# EAGLE design RF-Gen_RF-Stage (EAGLE 4.16)

## Sheet 1 of 4
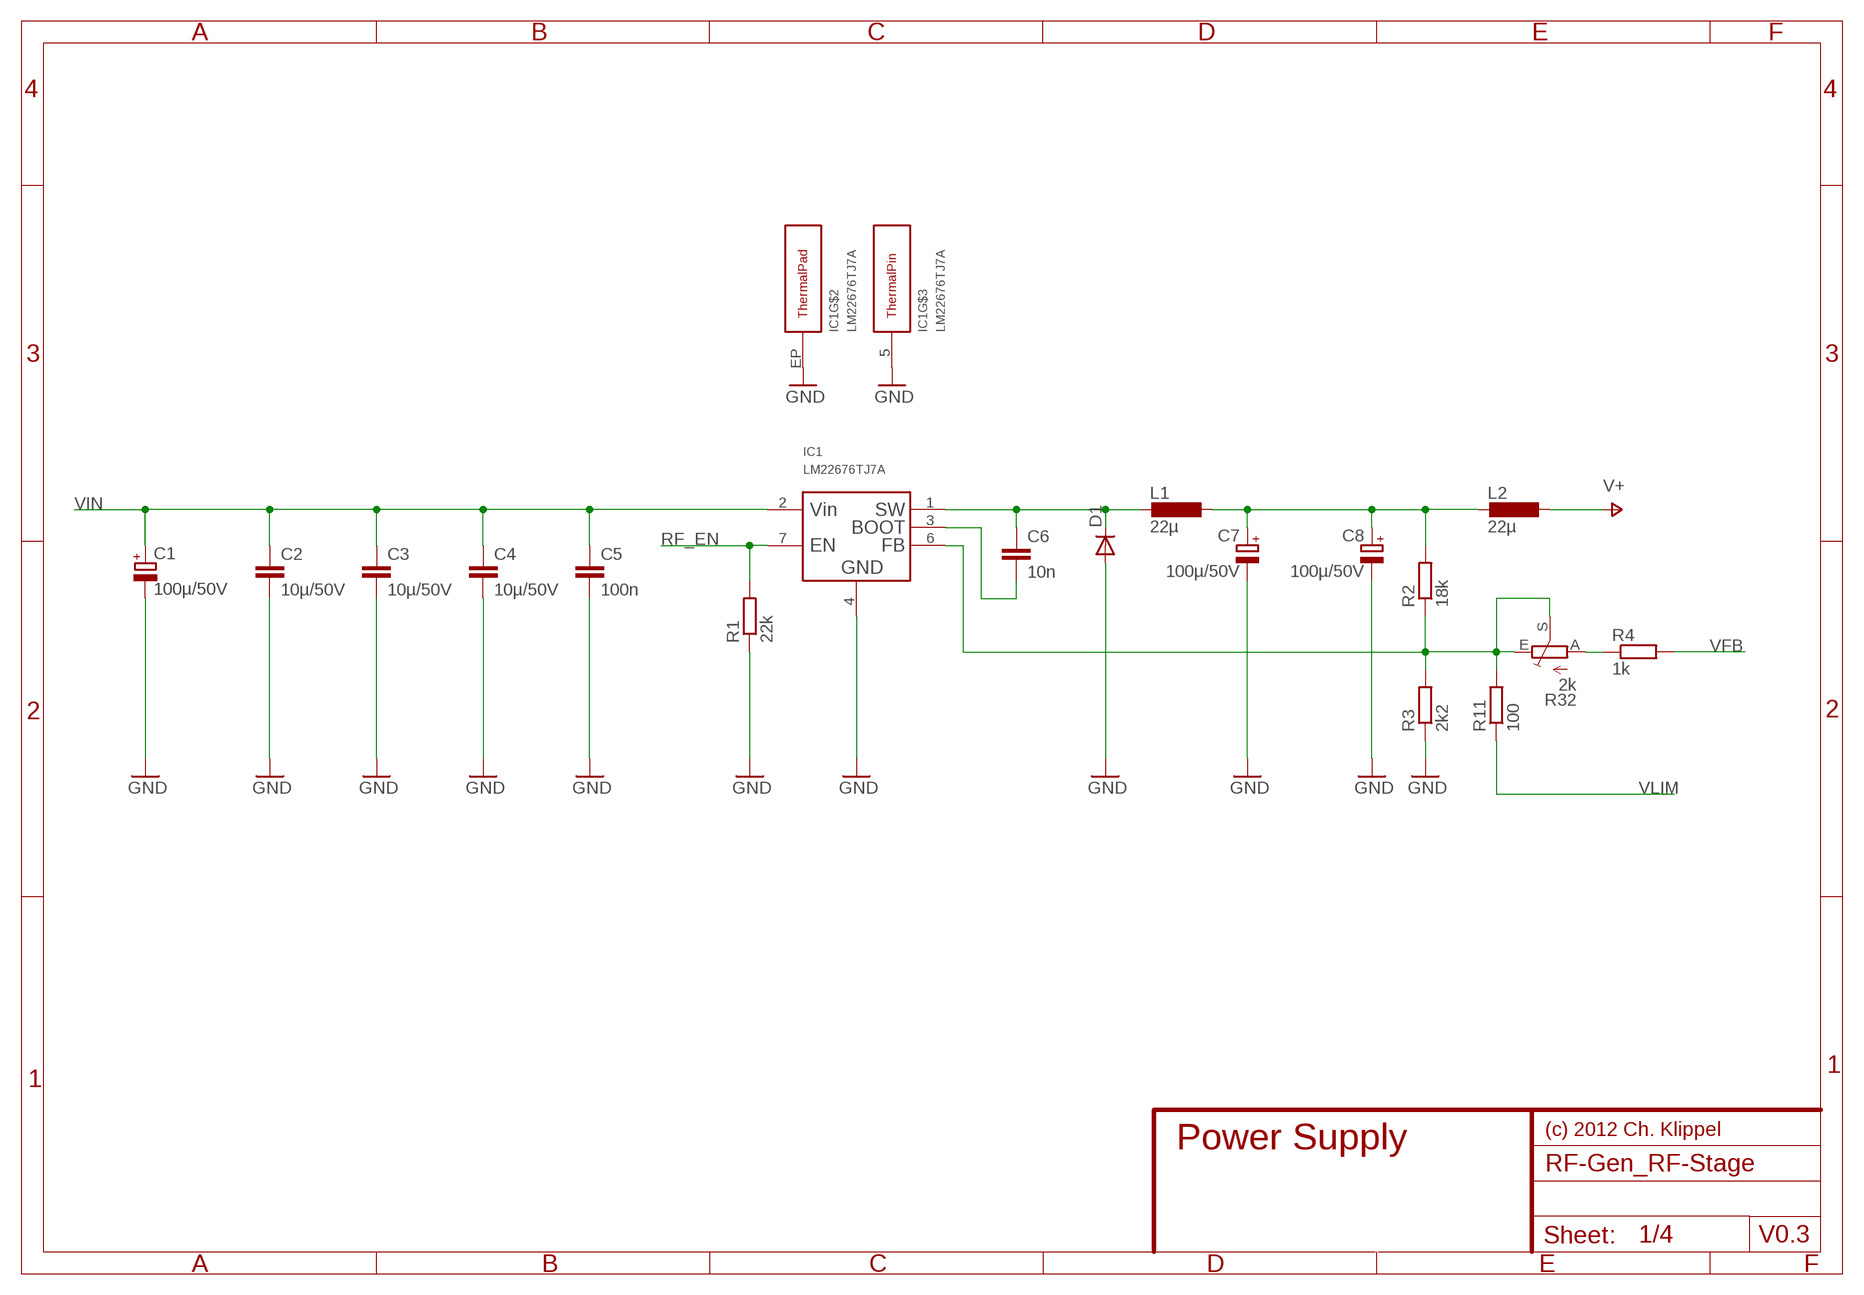
[diagram p0: schematic, sheet 1]

### Parts
C1  100µ/50V  C-POL-EU-AL_100_108  [CAP_AL_100_108]
C2  10µ/50V  C-EU-1210  [C_1210_REFLOW]
C3  10µ/50V  C-EU-1210  [C_1210_REFLOW]
C4  10µ/50V  C-EU-1210  [C_1210_REFLOW]
C5  100n  C-EU-0805  [C_0805_REFLOW]
C6  10n  C-EU-1206  [C_1206_REFLOW]
C7  100µ/50V  C-POL-EU-AL_100_108  [CAP_AL_100_108]
C8  100µ/50V  C-POL-EU-AL_100_108  [CAP_AL_100_108]
D1  DIODE-SMB  [SMB]
IC1  LM22676TJ7A  [TO-263_THIN]
L1  22µ  L-EU-SSR1260  [SSR1260]
L2  22µ  L-EU-SSR1260  [SSR1260]
R1  22k  R-EU-0805  [R_0805_REFLOW]
R2  18k  R-EU-0805  [R_0805_REFLOW]
R3  2k2  R-EU-0805  [R_0805_REFLOW]
R4  1k  R-EU-0805  [R_0805_REFLOW]
R11  100  R-EU-0805  [R_0805_REFLOW]
R32  2k  TRIM_EU-3364W  [3364W]

### Nets
GND: C1.- C2.P$2 C3.P$2 C4.P$2 C5.P$2 C7.- C8.- D1.A IC1.4(GND) IC1.5(THERMALPIN) IC1.EP(THERMALPAD) R1.P$1 R3.P$1 ; also sheet 2,3,4
N$8: C6.P$2 IC1.3(BOOT)
N$19: R4.P$1 R32.A
N$23: IC1.6(FB) R2.P$1 R3.P$2 R11.P$2 R32.E R32.S
RF_EN: IC1.7(EN) R1.P$2 ; also sheet 2,4
V+: L2.1 ; also sheet 2
VFB: R4.P$2 ; also sheet 4
VIN: C1.+ C2.P$1 C3.P$1 C4.P$1 C5.P$1 IC1.2(VIN) ; also sheet 4
VLIM: R11.P$1 ; also sheet 4
VREG: C7.+ C8.+ L1.1 L2.2 R2.P$2 ; also sheet 4
VSW: C6.P$1 D1.C IC1.1(SW) L1.2

### Notes on the sheet
- (c) 2012 Ch. Klippel
- Power Supply
- V0.3

## Sheet 2 of 4
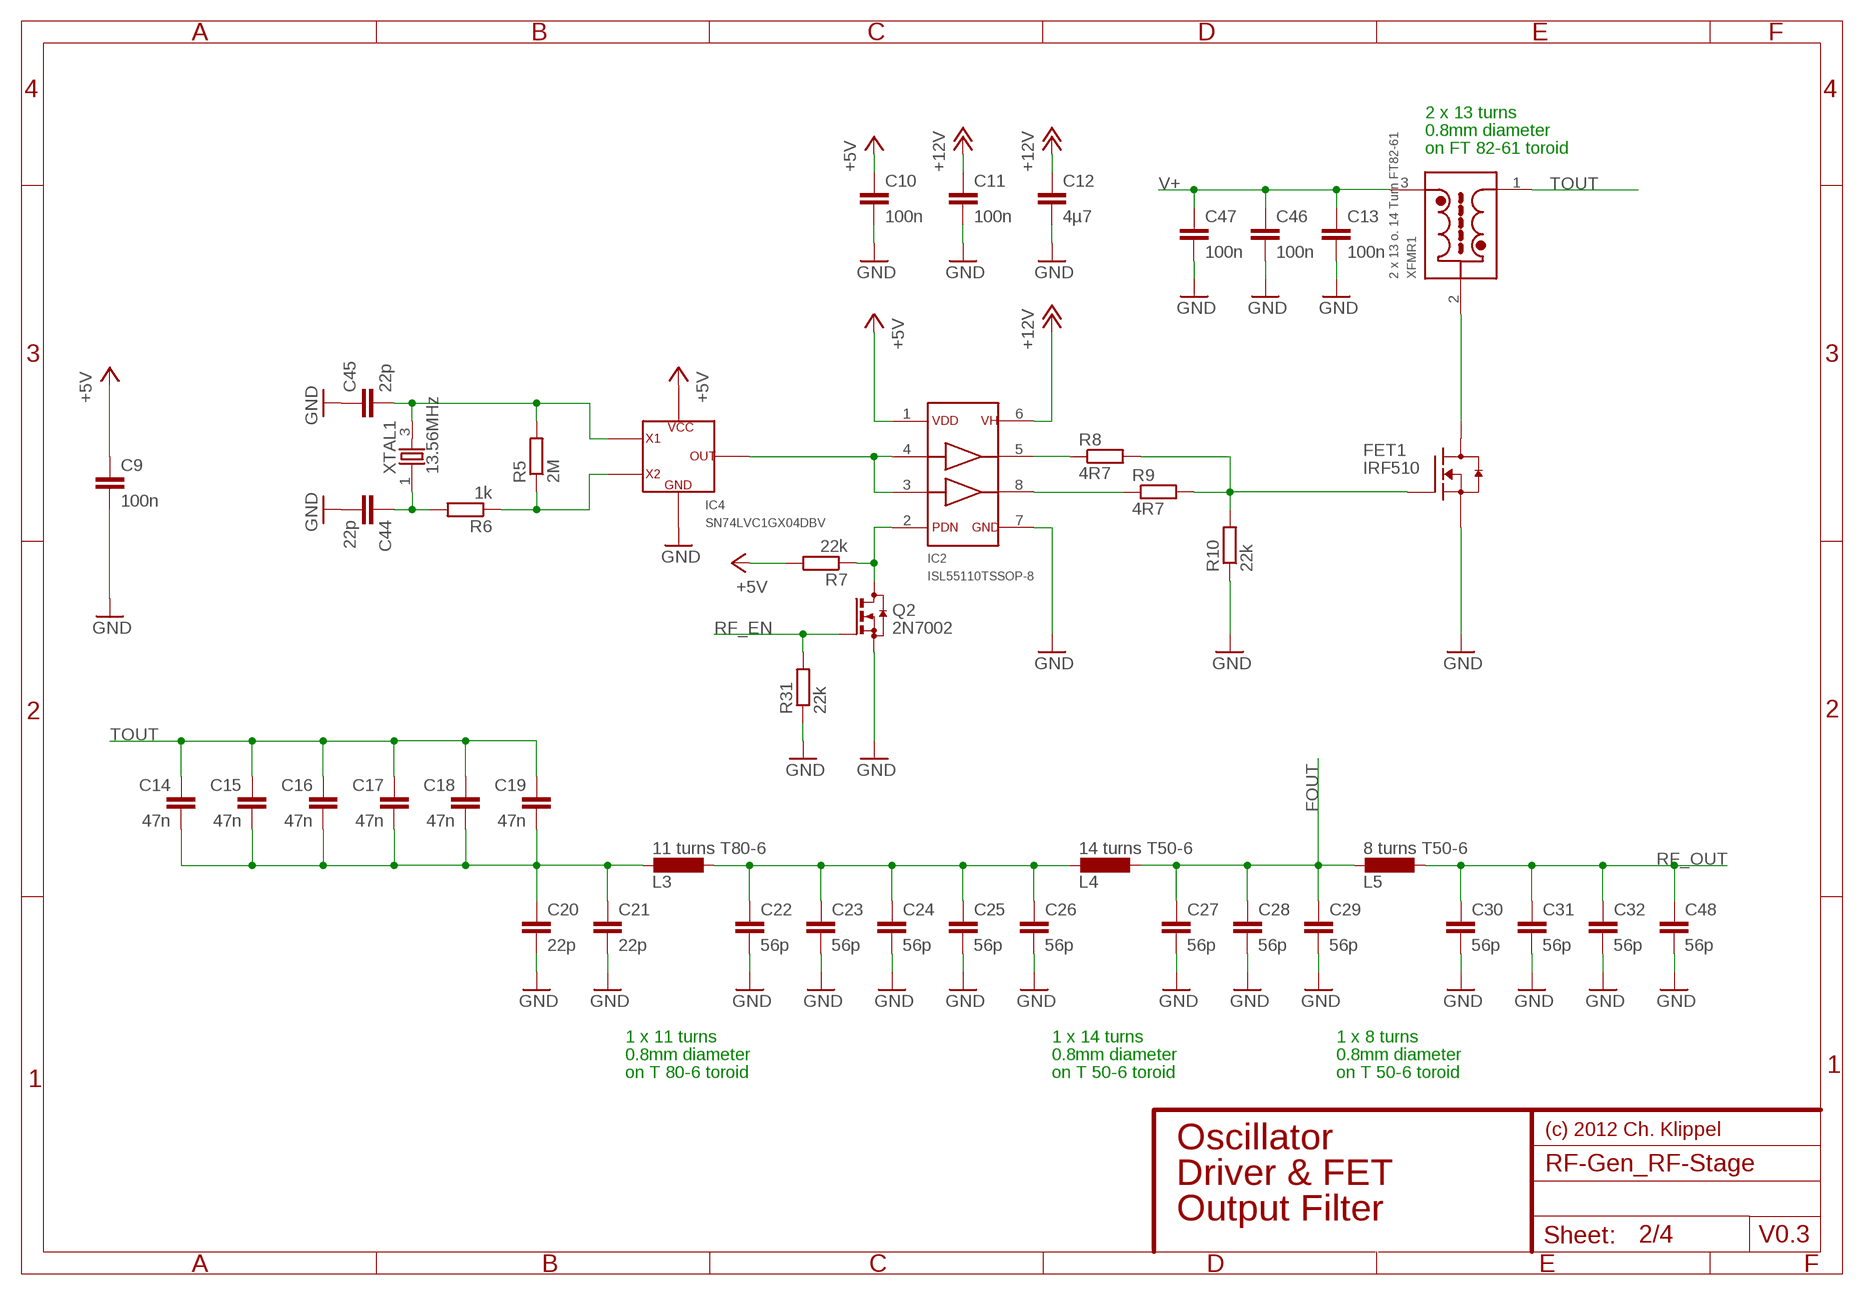
[diagram p1: schematic, sheet 2]

### Parts
C9  100n  C-EU-0805  [C_0805_REFLOW]
C10  100n  C-EU-0805  [C_0805_REFLOW]
C11  100n  C-EU-0805  [C_0805_REFLOW]
C12  4µ7  C-EU-1206  [C_1206_REFLOW]
C13  100n  C-EU-1206  [C_1206_REFLOW]
C14  47n  C-EU-1206  [C_1206_REFLOW]
C15  47n  C-EU-1206  [C_1206_REFLOW]
C16  47n  C-EU-1206  [C_1206_REFLOW]
C17  47n  C-EU-1206  [C_1206_REFLOW]
C18  47n  C-EU-1206  [C_1206_REFLOW]
C19  47n  C-EU-1206  [C_1206_REFLOW]
C20  22p  C-EU-1206  [C_1206_REFLOW]
C21  22p  C-EU-1206  [C_1206_REFLOW]
C22  56p  C-EU-1206  [C_1206_REFLOW]
C23  56p  C-EU-1206  [C_1206_REFLOW]
C24  56p  C-EU-1206  [C_1206_REFLOW]
C25  56p  C-EU-1206  [C_1206_REFLOW]
C26  56p  C-EU-1206  [C_1206_REFLOW]
C27  56p  C-EU-1206  [C_1206_REFLOW]
C28  56p  C-EU-1206  [C_1206_REFLOW]
C29  56p  C-EU-1206  [C_1206_REFLOW]
C30  56p  C-EU-1206  [C_1206_REFLOW]
C31  56p  C-EU-1206  [C_1206_REFLOW]
C32  56p  C-EU-1206  [C_1206_REFLOW]
C44  22p  C-EU-0805  [C_0805_REFLOW]
C45  22p  C-EU-0805  [C_0805_REFLOW]
C46  100n  C-EU-1206  [C_1206_REFLOW]
C47  100n  C-EU-1206  [C_1206_REFLOW]
C48  56p  C-EU-1206  [C_1206_REFLOW]
FET1  IRF510  NFETTO22_INPCB  [TO220_INPCB]
IC2  ISL55110TSSOP-8  [TSSOP-8]
IC4  SN74LVC1GX04DBV  [DBV-R-PDSO-G6]
L3  11 turns T80-6  L-EU-T80_U  [L_T80_U]
L4  14 turns T50-6  L-EU-T50_U  [L_T50_U]
L5  8 turns T50-6  L-EU-T50_U2  [L_T50_U2]
Q2  2N7002  BSS123  [SOT23]
R5  2M  R-EU-0805  [R_0805_REFLOW]
R6  1k  R-EU-0805  [R_0805_REFLOW]
R7  22k  R-EU-0805  [R_0805_REFLOW]
R8  4R7  R-EU-1206  [R_1206_REFLOW]
R9  4R7  R-EU-1206  [R_1206_REFLOW]
R10  22k  R-EU-0805  [R_0805_REFLOW]
R31  22k  R-EU-0805  [R_0805_REFLOW]
XFMR1  2 x 13 o. 14 Turn FT82-61  XFMR_1_1_CTT80_U  [XFMR_T80_U]
XTAL1  13.56MHz  XTALSMD_5.0X3.2  [XTAL_SMD_5.0X3.2]

### Nets
+5V: C9.P$1 C10.P$1 IC2.1(VDD) IC4.5(VCC) R7.P$2 ; also sheet 3,4
+12V: C11.P$1 C12.P$1 IC2.6(VH) ; also sheet 4
DRV_A: IC2.5(OUTA) R8.P$1
DRV_B: IC2.8(OUTB) R9.P$1
FIN: C14.P$2 C15.P$2 C16.P$2 C17.P$2 C18.P$2 C19.P$2 C20.P$1 C21.P$1 L3.2
FM: C22.P$1 C23.P$1 C24.P$1 C25.P$1 C26.P$1 L3.1 L4.2
FOUT: C27.P$1 C28.P$1 C29.P$1 L4.1 L5.2 ; also sheet 3
GATE: FET1.1(G) R8.P$2 R9.P$2 R10.P$2
GND: C9.P$2 C10.P$2 C11.P$2 C12.P$2 C13.P$2 C20.P$2 C21.P$2 C22.P$2 C23.P$2 C24.P$2 C25.P$2 C26.P$2 C27.P$2 C28.P$2 C29.P$2 C30.P$2 C31.P$2 C32.P$2 C44.P$2 C45.P$1 C46.P$2 C47.P$2 C48.P$2 FET1.3(S) IC2.7(GND) IC4.2(GND) Q2.2(S) R10.P$1 R31.P$1 ; also sheet 1,3,4
N$3: C45.P$2 IC4.3(X1) R5.P$2 XTAL1.3
N$4: FET1.2(D) XFMR1.2
N$6: IC2.3(INB) IC2.4(INA) IC4.6(OUT)
N$11: C44.P$1 R6.P$2 XTAL1.1
N$13: IC4.4(X2) R5.P$1 R6.P$1
N$15: IC2.2(PD) Q2.3(D) R7.P$1
RF_EN: Q2.1(G) R31.P$2 ; also sheet 1,4
RF_OUT: C30.P$1 C31.P$1 C32.P$1 C48.P$1 L5.1 ; also sheet 3
TOUT: C14.P$1 C15.P$1 C16.P$1 C17.P$1 C18.P$1 C19.P$1 XFMR1.1
V+: C13.P$1 C46.P$1 C47.P$1 XFMR1.3 ; also sheet 1

### Notes on the sheet
- 2 x 13 turns
- 0.8mm diameter
- on FT 82-61 toroid
- 1 x 11 turns | 1 x 14 turns | 1 x 8 turns
- 0.8mm diameter | 0.8mm diameter | 0.8mm diameter
- on T 80-6 toroid | on T 50-6 toroid | on T 50-6 toroid
- (c) 2012 Ch. Klippel
- Oscillator
- Driver & FET
- Output Filter
- V0.3

## Sheet 3 of 4
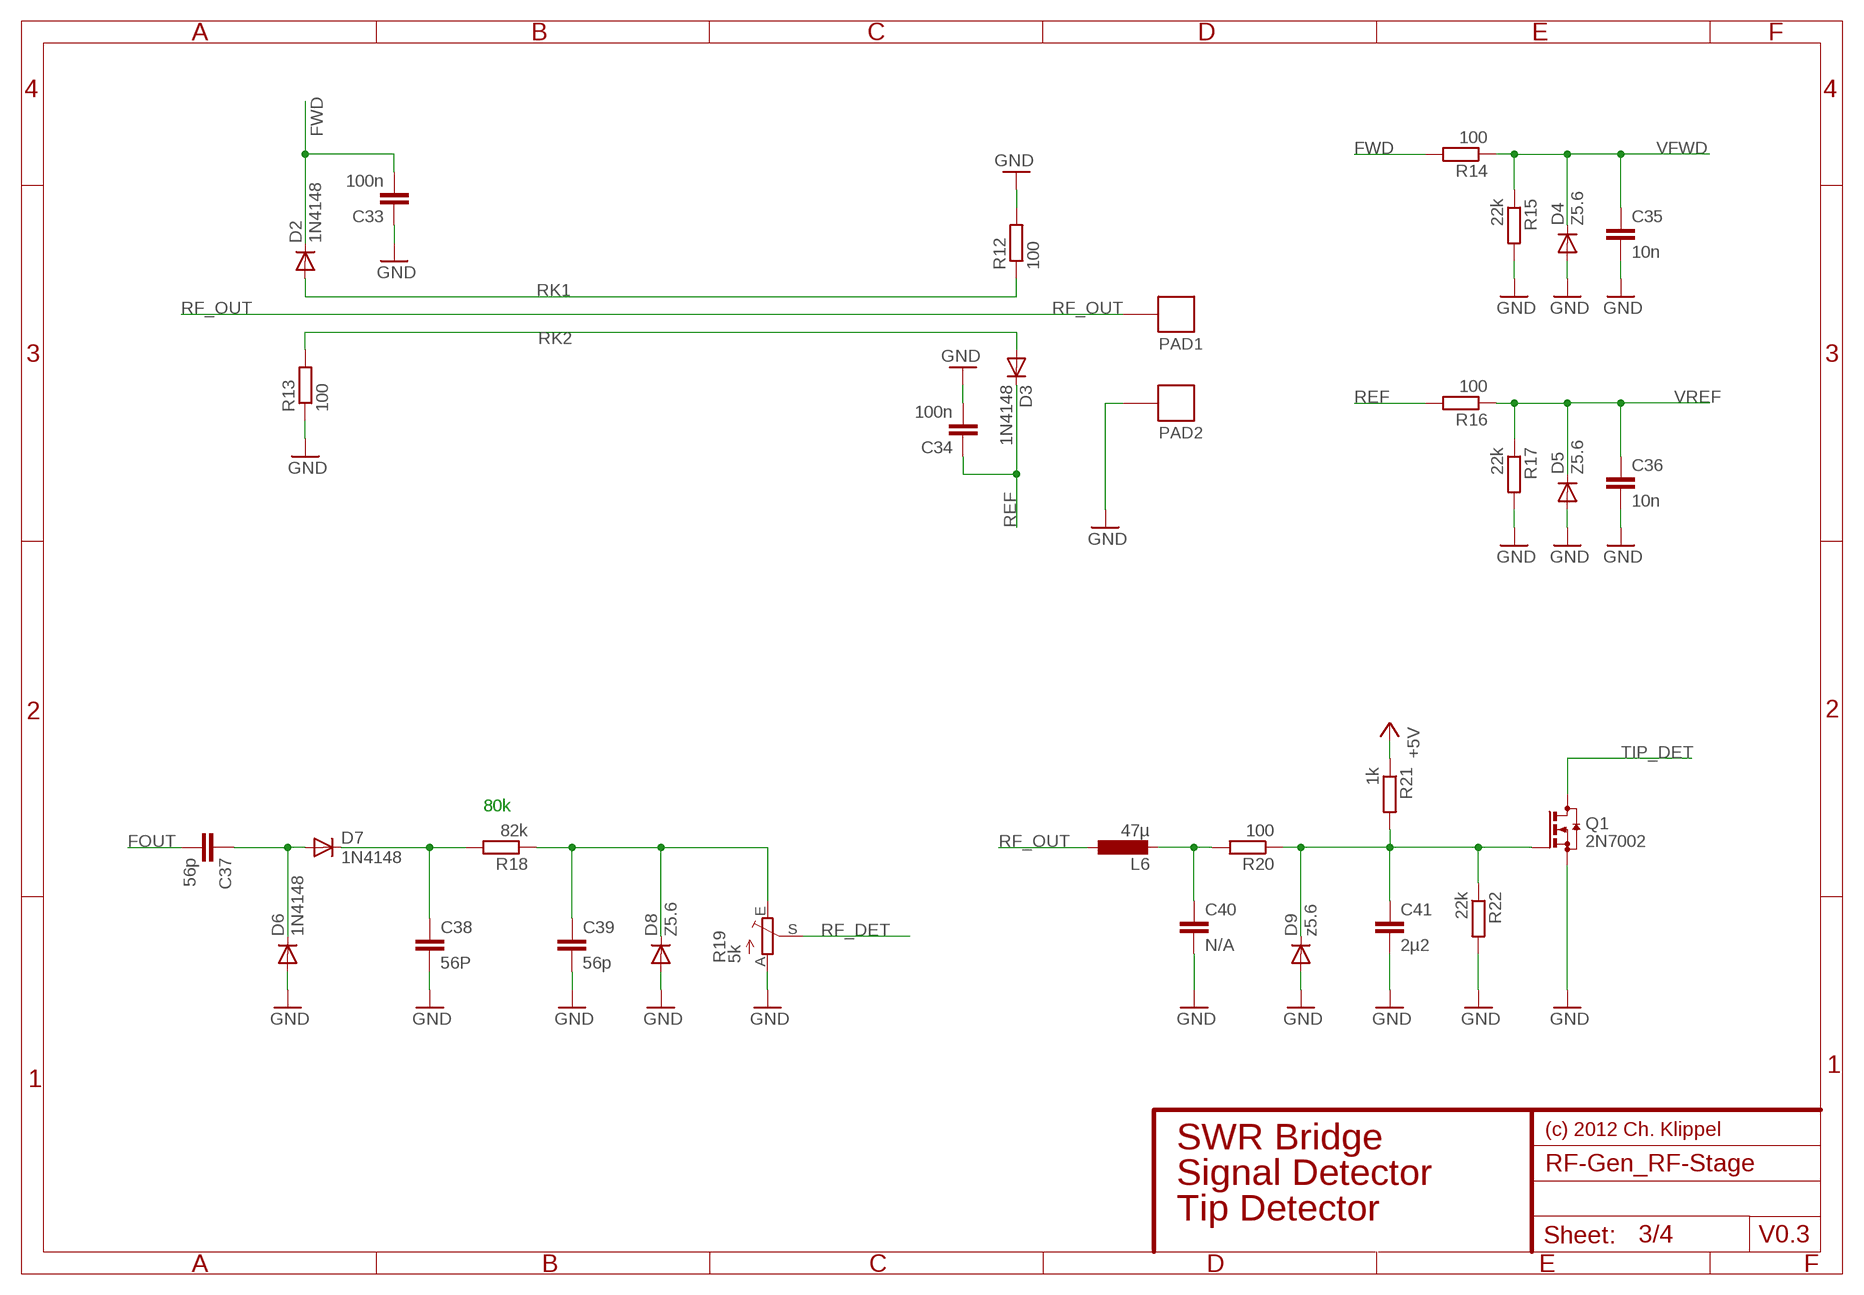
[diagram p2: schematic, sheet 3]

### Parts
C33  100n  C-EU-0805  [C_0805_REFLOW]
C34  100n  C-EU-0805  [C_0805_REFLOW]
C35  10n  C-EU-0805  [C_0805_REFLOW]
C36  10n  C-EU-0805  [C_0805_REFLOW]
C37  56p  C-EU-1206  [C_1206_REFLOW]
C38  56P  C-EU-1206  [C_1206_REFLOW]
C39  56p  C-EU-1206  [C_1206_REFLOW]
C40  N/A  C-EU-0805  [C_0805_REFLOW]
C41  2µ2  C-EU-1206  [C_1206_REFLOW]
D2  1N4148  DIODE-LL-34  [LL-34]
D3  1N4148  DIODE-LL-34  [LL-34]
D4  Z5.6  DIODE-LL-34  [LL-34]
D5  Z5.6  DIODE-LL-34  [LL-34]
D6  1N4148  DIODE-LL-34  [LL-34]
D7  1N4148  DIODE-LL-34  [LL-34]
D8  Z5.6  DIODE-LL-34  [LL-34]
D9  z5.6  DIODE-LL-34  [LL-34]
L6  47µ  L-EU-2424  [L_2424]
PAD1  SMDPAD5X4  [SMDPAD_5X4]
PAD2  SMDPAD5X4  [SMDPAD_5X4]
Q1  2N7002  BSS123  [SOT23]
R12  100  R-EU-0805  [R_0805_REFLOW]
R13  100  R-EU-0805  [R_0805_REFLOW]
R14  100  R-EU-0805  [R_0805_REFLOW]
R15  22k  R-EU-0805  [R_0805_REFLOW]
R16  100  R-EU-0805  [R_0805_REFLOW]
R17  22k  R-EU-0805  [R_0805_REFLOW]
R18  82k  R-EU-0805  [R_0805_REFLOW]
R19  5k  TRIM_EU-S64Y_SMD  [S64Y_SMD]
R20  100  R-EU-0805  [R_0805_REFLOW]
R21  1k  R-EU-0805  [R_0805_REFLOW]
R22  22k  R-EU-0805  [R_0805_REFLOW]

### Nets
+5V: R21.P$1 ; also sheet 2,4
FOUT: C37.P$2 ; also sheet 2
FWD: C33.P$2 D2.C R14.P$2
GND: C33.P$1 C34.P$2 C35.P$2 C36.P$2 C38.P$2 C39.P$2 C40.P$2 C41.P$2 D4.A D5.A D6.A D8.A D9.A PAD2.1 Q1.2(S) R12.P$2 R13.P$1 R15.P$2 R17.P$2 R19.A R22.P$2 ; also sheet 1,2,4
N$1: C41.P$1 D9.C Q1.1(G) R20.P$1 R21.P$2 R22.P$1
N$2: C40.P$1 L6.2 R20.P$2
N$5: C37.P$1 D6.C D7.A
N$9: C39.P$1 D8.C R18.P$1 R19.E
N$14: C38.P$1 D7.C R18.P$2
REF: C34.P$1 D3.C R16.P$2
RF_DET: R19.S ; also sheet 4
RF_OUT: L6.1 PAD1.1 ; also sheet 2
RK1: D2.A R12.P$1
RK2: D3.A R13.P$2
TIP_DET: Q1.3(D) ; also sheet 4
VFWD: C35.P$1 D4.C R14.P$1 R15.P$1 ; also sheet 4
VREF: C36.P$1 D5.C R16.P$1 R17.P$1 ; also sheet 4

### Notes on the sheet
- 80k
- (c) 2012 Ch. Klippel
- SWR Bridge
- Signal Detector
- Tip Detector
- V0.3

## Sheet 4 of 4
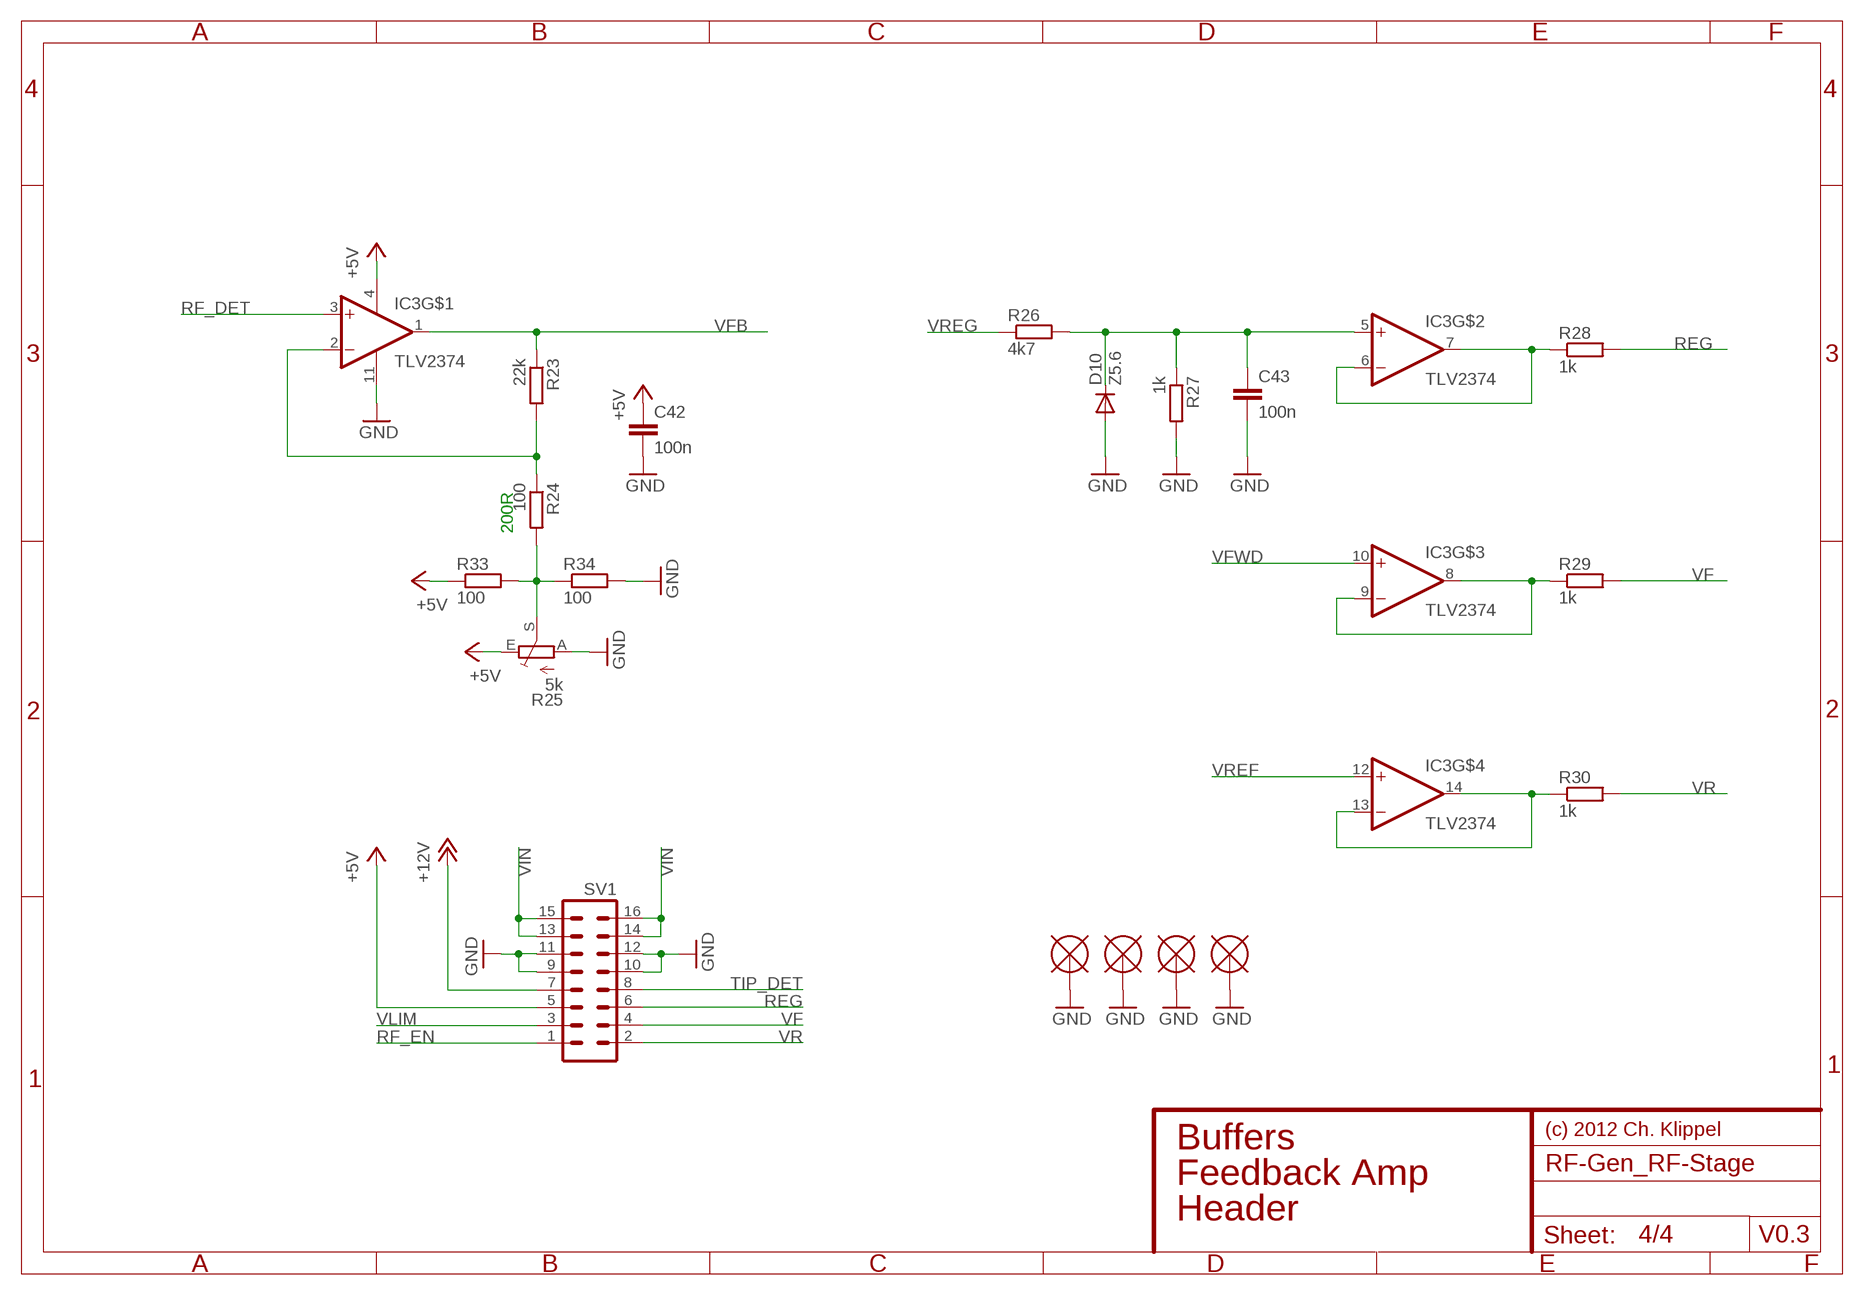
[diagram p3: schematic, sheet 4]

### Parts
C42  100n  C-EU-0805  [C_0805_REFLOW]
C43  100n  C-EU-0805  [C_0805_REFLOW]
D10  Z5.6  DIODE-LL-34  [LL-34]
IC3  TLV2374  TLV2374SOIC-14  [SOIC14]
R23  22k  R-EU-0805  [R_0805_REFLOW]
R24  100  R-EU-0805  [R_0805_REFLOW]
R25  5k  TRIM_EU-S64Y_SMD  [S64Y_SMD]
R26  4k7  R-EU-0805  [R_0805_REFLOW]
R27  1k  R-EU-0805  [R_0805_REFLOW]
R28  1k  R-EU-0805  [R_0805_REFLOW]
R29  1k  R-EU-0805  [R_0805_REFLOW]
R30  1k  R-EU-0805  [R_0805_REFLOW]
R33  100  R-EU-0805  [R_0805_REFLOW]
R34  100  R-EU-0805  [R_0805_REFLOW]
SV1  MA08-2SMD  [MA08-2-SMD]
U$1  MOUNTPADM3_WASHER  [PAD_M3_WASHER]
U$2  MOUNTPADM3_WASHER  [PAD_M3_WASHER]
U$3  MOUNTPADM3_WASHER  [PAD_M3_WASHER]
U$4  MOUNTPADM3_WASHER  [PAD_M3_WASHER]

### Nets
+5V: C42.P$1 IC3.4(V+) R25.E R33.P$1 SV1.5 ; also sheet 2,3
+12V: SV1.7 ; also sheet 2
GND: C42.P$2 C43.P$2 D10.A IC3.11(V-) R25.A R27.P$2 R34.P$2 SV1.9 SV1.10 SV1.11 SV1.12 U$1.P$1 U$2.P$1 U$3.P$1 U$4.P$1 ; also sheet 1,2,3
N$7: C43.P$1 D10.C IC3.5(+IN) R26.P$2 R27.P$1
N$16: IC3.2(-IN) R23.P$2 R24.P$1
N$17: R24.P$2 R25.S R33.P$2 R34.P$1
N$21: IC3.8(OUT) IC3.9(-IN) R29.P$1
N$22: IC3.6(-IN) IC3.7(OUT) R28.P$1
N$24: IC3.13(-IN) IC3.14(OUT) R30.P$1
REG: R28.P$2 SV1.6
RF_DET: IC3.3(+IN) ; also sheet 3
RF_EN: SV1.1 ; also sheet 1,2
TIP_DET: SV1.8 ; also sheet 3
VF: R29.P$2 SV1.4
VFB: IC3.1(OUT) R23.P$1 ; also sheet 1
VFWD: IC3.10(+IN) ; also sheet 3
VIN: SV1.13 SV1.14 SV1.15 SV1.16 ; also sheet 1
VLIM: SV1.3 ; also sheet 1
VR: R30.P$2 SV1.2
VREF: IC3.12(+IN) ; also sheet 3
VREG: R26.P$1 ; also sheet 1

### Notes on the sheet
- 200R
- (c) 2012 Ch. Klippel
- Buffers
- Feedback Amp
- Header
- V0.3

## Library data of the parts
C1 C7 C8 = parts:C-POL-EU-
C2-C6 C9-C48 = parts:C-EU-
D1-D10 = parts:DIODE-: RECTIFIER DIODES
FET1 = parts:NFET
IC1 = parts:LM22676
IC2 = parts:ISL55110
IC3 = parts:TLV2374
IC4 = parts:SN74LVC1GX04
L1-L6 = parts:L-EU-
PAD1 PAD2 = parts:SMDPAD
Q1 Q2 = parts:BSS123: N-CHANNEL MOS FET
R1-R18 R20-R24 R26-R31 R33 R34 = parts:R-EU-
R19 R25 R32 = parts:TRIM_EU-: POTENTIOMETER
SV1 = parts:MA08-2: PIN HEADER
U$1-U$4 = parts:MOUNTPAD
XFMR1 = parts:XFMR_1_1_CT
XTAL1 = parts:XTAL

## Board
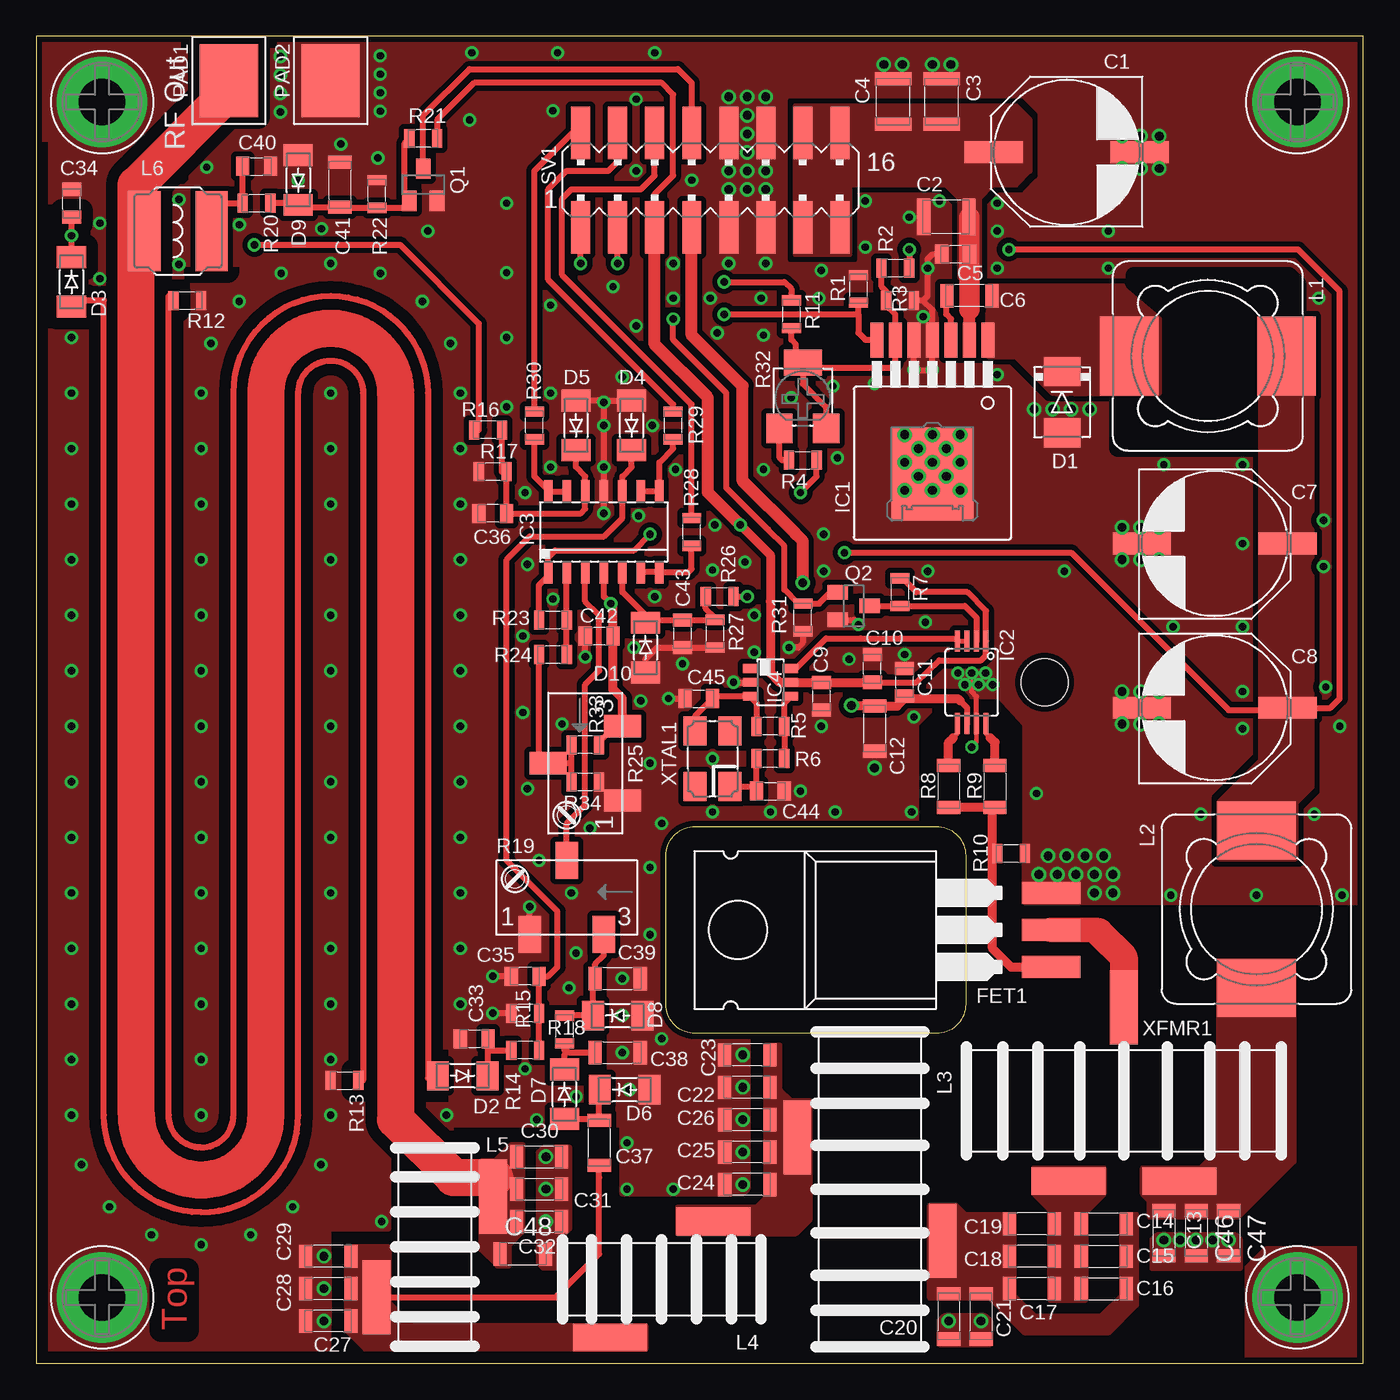
[diagram p4: board, top side]
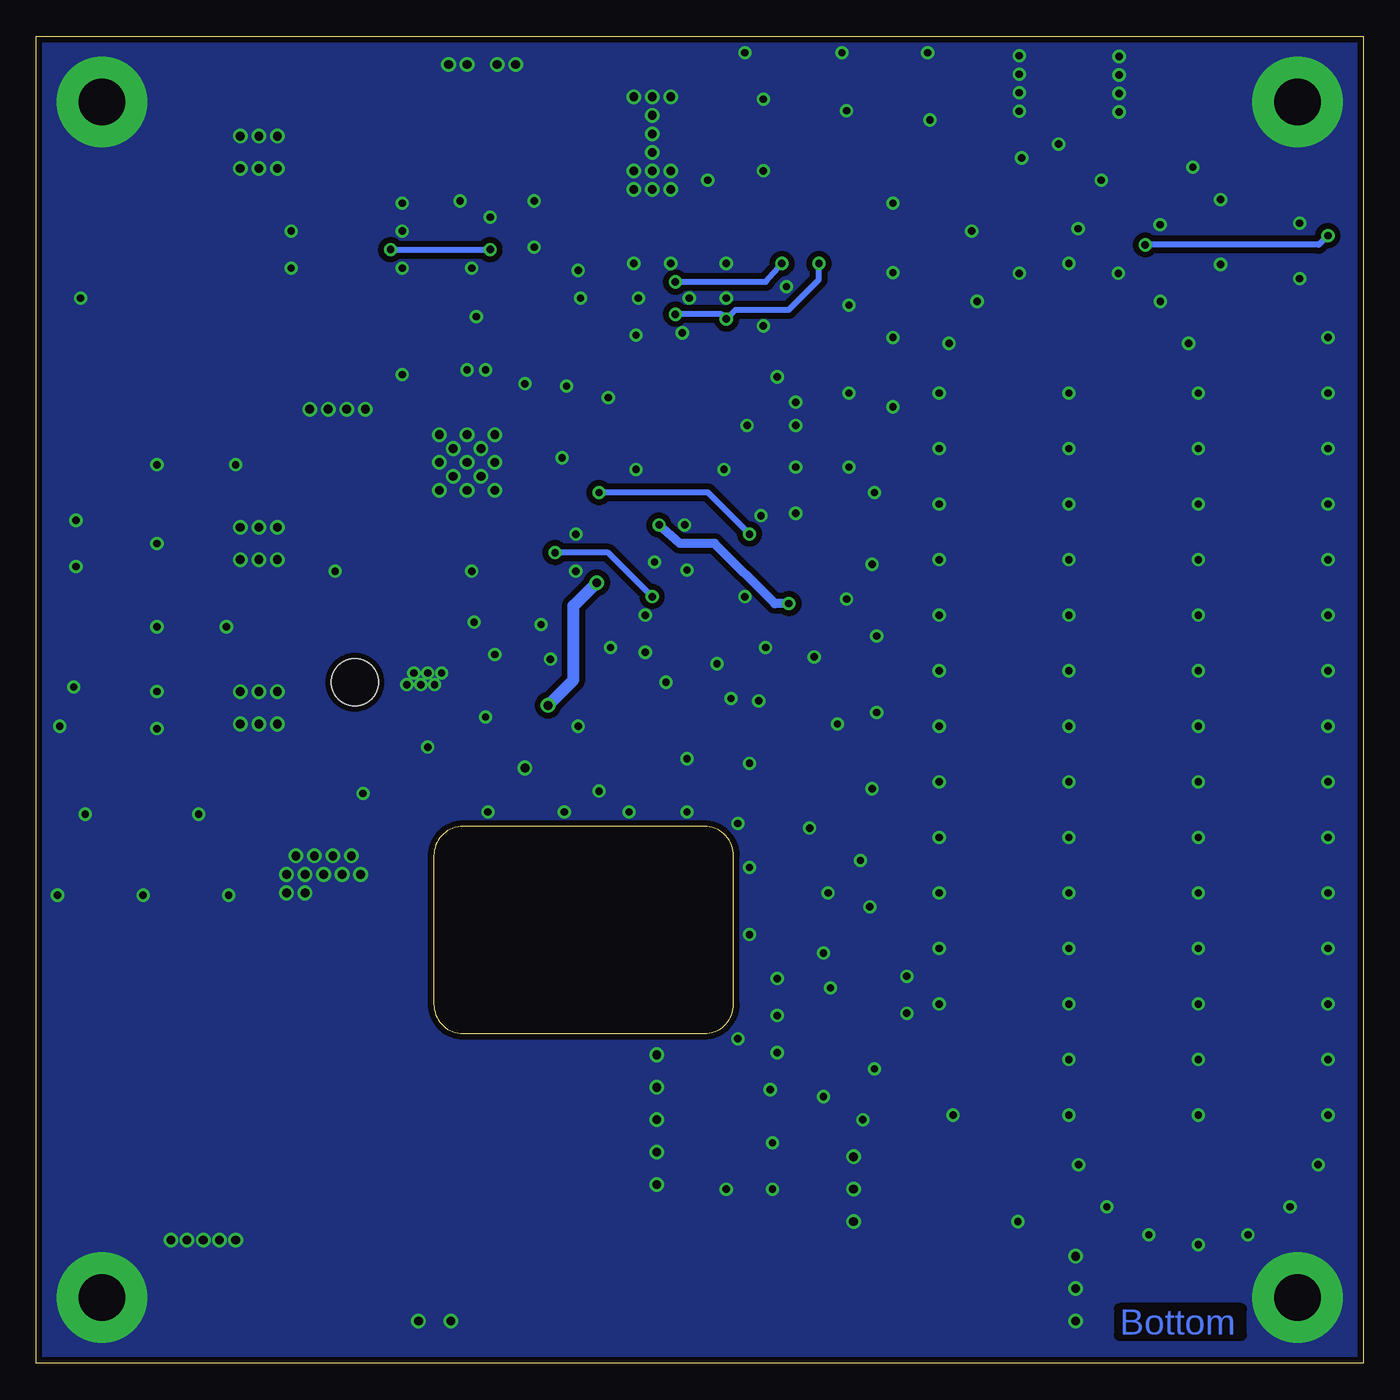
[diagram p5: board, bottom side, seen from below]

Size 91 x 91 mm. Coordinates in mm from the lower left corner, seen from the top.
Outline: 0,0 91,0 91,91 0,91 0,0
Copper layers (1*16): Top 0.035mm / dielectric 1.5mm / Bottom 0.035mm
Design rules "pcb-devboards": minimum track width 0.2mm, minimum drill 0.4mm, track to track 0.2mm, track to pad 0.2mm, pad to pad 0.2mm, via to via 0.2mm, smd to smd 0mil, copper to edge 0.4mm, drill to drill 0.2mm, minimum pad ring 0.2mm, minimum via ring 0.2mm, stop-mask expansion 0.1mm, vias tented up to drill 0.6mm, thermal gap 0.2mm
Holes 3.2 mm at 69.16,46.7
tRestrict: area 74.2,62.7 to 86.5,74.6

### Footprints (pad centres in the part's own frame; a part is rotated, then mirrored left to right if it is on the bottom)
CAP_AL_100_108 = smd 4 x 1.5: + -5,0; - 5,0
C_1210_REFLOW = smd 0.9 x 2.5: P$1 -1.55,0; P$2 1.55,0
C_0805_REFLOW = smd 0.9 x 1.3: P$1 -0.95,0; P$2 0.95,0
C_1206_REFLOW = smd 0.9 x 1.6: P$1 -1.55,0; P$2 1.55,0
SMB = smd 2 x 2.5: A 2.1,0; C -2.1,0
LL-34 = smd 1.5 x 2: A 1.7,0; C -1.7,0
TO220_INPCB = smd 1.5 x 4: 1 -2.54,-21.47; 2 0,-21.47; 3 2.54,-21.47
TO-263_THIN = smd 0.91 x 2.41: 1 -3.81,-8.4; 2 -2.54,-8.4; 3 -1.27,-8.4; 4 0,-8.4; 5 1.27,-8.4; 6 2.54,-8.4; 7 3.81,-8.4 | smd 5.59 x 6.35: EP 0,0.8
TSSOP-8 = smd 0.35 x 1.45: 1 -0.975,-2.825; 2 -0.325,-2.825; 3 0.325,-2.825; 4 0.975,-2.825; 5 0.975,2.825; 6 0.325,2.825; 7 -0.325,2.825; 8 -0.975,2.825
SOIC14 = smd 0.6 x 1.55: 1 -3.81,-2.77; 2 -2.54,-2.77; 3 -1.27,-2.77; 4 0,-2.77; 5 1.27,-2.77; 6 2.54,-2.77; 7 3.81,-2.77; 8 3.81,2.77; 9 2.54,2.77; 10 1.27,2.77; 11 0,2.77; 12 -1.27,2.77; 13 -2.54,2.77; 14 -3.81,2.77
DBV-R-PDSO-G6 = smd 0.6 x 1.05: 1 -0.95,-1.35; 2 0,-1.35; 3 0.95,-1.35; 4 0.95,1.35; 5 0,1.35; 6 -0.95,1.35
SSR1260 = smd 4 x 5.4: 1 -5.4,0; 2 5.4,0
L_T80_U = smd 5.08 x 1.905: 1 -3.54,-4.992; 2 3.54,4.992
L_T50_U = smd 5.08 x 1.905: 1 -3.54,-3.993; 2 3.54,3.993
L_T50_U2 = smd 5.08 x 1.905: 1 3.46,-3.993; 2 -3.46,3.993
L_2424 = smd 2.2 x 5.5: 1 -2.3,0; 2 2.3,0
SMDPAD_5X4 = smd 5 x 4: 1 0,0
SOT23 = smd 1 x 1.4: 1 -0.95,-1.1; 2 0.95,-1.1; 3 0,1.1
R_0805_REFLOW = smd 0.7 x 1.3: P$1 -0.95,0; P$2 0.95,0
R_1206_REFLOW = smd 0.9 x 1.6: P$1 -1.45,0; P$2 1.45,0
S64Y_SMD = smd 1.524 x 2.54: A 2.54,2.54; E -2.54,2.54; S 0,-2.54
3364W = smd 1.8 x 2: A -1.6,-2.1; E 1.6,-2.1 | smd 2.6 x 1.8: S 0,2.4
MA08-2-SMD = smd 1.3 x 3.6: 1 -8.89,-3.24; 2 -8.89,3.24; 3 -6.35,-3.24; 4 -6.35,3.24; 5 -3.81,-3.24; 6 -3.81,3.24; 7 -1.27,-3.24; 8 -1.27,3.24; 9 1.27,-3.24; 10 1.27,3.24; 11 3.81,-3.24; 12 3.81,3.24; 13 6.35,-3.24; 14 6.35,3.24; 15 8.89,-3.24; 16 8.89,3.24
PAD_M3_WASHER = drill 3.2 pad 6.2 round: P$1 0,0
XFMR_T80_U = smd 5.08 x 1.905: 1 -3.81,-5.492; 3 3.81,-5.492 | smd 1.905 x 5.08: 2 0,6.42
XTAL_SMD_5.0X3.2 = smd 2 x 1.6: 1 -1.9,-1.2; 2 1.9,-1.2; 3 1.9,1.2; 4 -1.9,1.2

### Placement (x,y rotation side)
C1  70.67,83.05 0 top
C2  62.41,78.61 180 top
C3  62.09,86.54 90 top
C4  58.76,86.54 90 top
C5  63.05,76.06 180 top
C6  64,73.21 180 top
C7  80.83,56.22 180 top
C8  80.83,44.95 180 top
C9  53.84,45.74 270 top
C10  57.33,47.65 90 top
C11  59.56,46.7 90 top
C12  57.49,43.52 270 top
C13  77.33,8.91 270 top
C14  73.21,9.55 0 top
C15  73.21,7.33 0 top
C16  73.21,5.1 0 top
C17  68.29,5.1 180 top
C18  68.29,7.33 180 top
C19  68.29,9.55 180 top
C20  62.57,3.2 270 top
C21  64.79,3.2 270 top
C22  48.76,18.91 180 top
C23  48.76,21.14 180 top
C24  48.76,12.25 180 top
C25  48.76,14.47 180 top
C26  48.76,16.69 180 top
C27  20.03,2.88 180 top
C28  20.03,5.1 180 top
C29  20.03,7.33 180 top
C30  34.47,14.15 0 top
C31  34.47,11.93 0 top
C32  34.47,9.71 0 top
C33  30.03,22.25 0 top
C34  2.41,79.56 90 top
C35  33.52,26.54 180 top
C36  31.3,58.28 180 top
C37  38.6,15.11 270 top
C38  39.87,21.3 0 top
C39  39.87,26.38 0 top
C40  15.11,82.1 0 top
C41  20.82,80.83 90 top
C42  38.6,49.87 180 top
C43  44.31,50.03 270 top
C44  50.35,39.23 0 top
C45  45.43,45.59 0 top
C46  79.56,8.91 270 top
C47  81.78,8.91 270 top
C48  33.36,7.49 0 top
D1  70.35,65.91 270 top
D2  29.23,19.71 180 top
D3  2.41,74.16 270 top
D4  40.82,64.32 90 top
D5  37.01,64.32 90 top
D6  40.35,18.76 0 top
D7  36.22,18.44 270 top
D8  39.87,23.84 0 top
D9  17.96,81.14 90 top
D10  41.77,49.08 270 top
FET1  48.12,29.71 90 top
IC1  61.46,61.78 180 top
IC2  64.16,46.7 180 top
IC3  38.92,57.02 0 top
IC4  50.35,46.7 270 top
L1  80.35,69.08 180 top
L2  83.69,31.14 90 top
L3  57.17,11.93 270 top
L4  42.89,5.74 0 top
L5  27.33,7.96 90 top
L6  9.71,77.65 0 top
PAD1  13.2,87.97 270 top
PAD2  20.18,87.97 270 top
Q1  26.54,80.83 0 top
Q2  56.06,51.94 270 top
R1  56.38,73.68 270 top
R2  58.92,75.11 0 top
R3  59.24,72.89 180 top
R4  52.57,61.94 0 top
R5  50.35,43.68 180 top
R6  50.35,41.46 180 top
R7  59.24,52.89 90 top
R8  62.57,39.55 270 top
R9  65.75,39.55 270 top
R10  66.86,34.95 180 top
R11  51.78,71.94 270 top
R12  10.34,72.89 0 top
R13  21.14,19.39 0 top
R14  33.52,21.45 180 top
R15  33.52,24 180 top
R16  30.98,64 180 top
R17  31.3,61.14 180 top
R18  36.22,22.88 270 top
R19  36.38,31.93 180 top
R20  15.11,79.56 180 top
R21  26.54,84 180 top
R22  23.36,80.19 90 top
R23  35.42,50.98 0 top
R24  35.42,48.6 180 top
R25  37.65,41.14 270 top
R26  46.86,52.57 180 top
R27  46.54,50.03 270 top
R28  44.95,57.02 90 top
R29  43.68,64.32 90 top
R30  34.16,64.32 90 top
R31  52.57,51.14 90 top
R32  52.57,66.22 0 top
R33  37.65,42.41 180 top
R34  37.65,39.87 0 top
SV1  46.22,81.14 0 top
U$1  86.5,86.5 0 top
U$2  86.5,4.5 0 top
U$3  4.5,86.5 0 top
U$4  4.5,4.5 0 top
XFMR1  74.59,17.98 0 top
XTAL1  46.38,41.46 90 top

### Tracks (layer width: path | path; a pad name or v marks a point on that pad's centre or on a via)
+5V  (via drill 0.5)
  Top 0.406: SV1.5 42.41,80.19 43.68,81.46 43.68,87.02 42.89,87.81 30.03,87.81 27.49,85.27 R21.P$1 | 39.55,50.03 C42.P$1 | IC3.4 38.92,52.57 v39.39,52.09 | 57.65,46.7 60.35,46.7 61.94,48.2 64.79,48.2 65.13,48.54 IC2.1 65.13,51.59 63.84,52.88 60.35,52.89 59.4,53.84 R7.P$2 | C9.P$1 | C9.P$1 | R25.E 39.71,43.68 38.6,42.57 R33.P$1
  Top 0.61: R25.E 40.19,45.59 39.55,46.22 C42.P$1 | v48.28,57.49 50.35,55.43 50.35,52.25 50.35,47.33 50.98,46.7 IC4.5 C9.P$1 57.65,46.7 C10.P$1 | 39.55,50.03 39.55,51.94 v39.39,52.09
  Top 0.813: SV1.5 42.41,69.87 46.06,66.22 46.06,59.71 48.12,57.65 v48.28,57.49
  Bottom 0.61: v39.39,52.09 40.35,52.09 44.47,56.22 46.85,56.22 v48.28,57.49 | v48.28,57.49
+12V  (via drill 0.6)
  Top 0.406: 63.37,45.43 63.83,44.96 IC2.6
  Top 0.61: 63.37,45.43 63.21,45.59 59.55,45.59 | 57.49,45.11 | 57.49,45.11 C12.P$1 59.04,45.07 59.55,45.59 | v55.9,45.11 57.49,45.11 | 57.49,45.11 | 59.55,45.59 C11.P$1
  Top 0.813: SV1.7 44.95,70.51 48.44,67.02 48.44,60.51 52.09,56.86 52.57,56.38 v52.57,53.52
  Bottom 0.813: v52.57,53.52 54.16,51.94 54.16,46.85 v55.9,45.11 | v55.9,45.11
DRV_A
  Top 0.305: IC2.5 63.18,43.18 62.89,42.89
  Top 0.61: 62.89,42.89 62.57,42.57 R8.P$1
DRV_B
  Top 0.305: IC2.8 65.13,43.18 65.43,42.89
  Top 0.61: 65.43,42.89 65.75,42.57 R9.P$1
FIN
  pour Top (rank 3, no thermals): 61.3,4.47 61.3,10.82 63.05,10.82 63.68,10.18 67.02,10.18 67.02,4.63 68.45,3.2 73.05,3.2 74.48,4.63 74.48,10.18 75.43,10.18 75.43,3.99 73.53,2.09 67.81,2.09 65.43,4.47
FM
  pour Top (isolate 0.356, rank 3, no thermals): 44,10.66 44,8.91 52.09,8.91 53.05,9.87 53.05,17.96 51.78,17.96 50.98,18.76 50.98,21.77 50.03,21.77 50.03,11.29 49.4,10.66
FOUT
  Top 0.406: L5.2 35.62,4.5 38.6,7.49 38.6,12.72 | 38.6,12.72 | 38.6,12.72 C37.P$2
  pour Top (isolate 0.61, rank 3, no thermals): 22.57,0.98 21.3,2.25 21.3,7.96 24.15,7.96 24.15,4.15 25.74,2.56 41.78,2.56 41.77,0.98
FWD
  Top 0.406: D2.C 30.98,19.71 30.98,20.03 30.98,21.45 | 30.98,21.45 C33.P$2 | 30.98,21.45 R14.P$2
GATE
  Top 0.406: FET1.1 70.03,27.17 | 65.59,34.95 R10.P$2
  Top 0.61: FET1.1 66.86,27.17 65.59,28.44 65.59,34.95 65.59,38.12 R9.P$2 65.75,38.12 65.72,38.1 R8.P$2
GND  (via drill 0.5, 0.6)
  Top 0.305: v64.16,42.25 | IC2.7 64.48,42.58 v64.16,42.25
  Top 0.356: IC2.7 64.48,45.74 64.16,46.06 64.16,46.7
  Top 0.406: R19.A v33.84,31.3 | v37.65,48.44 C42.P$2 | R15.P$2 v31.3,24 | C35.P$2 v31.3,26.54 | v38.92,58.28 IC3.11 | 38.92,59.87 v38.92,65.91 | D5.A 38.8,66.02 v38.92,65.91 | D4.A 39.03,66.02 v38.92,65.91 | IC1.5 v60.19,68.13 v61.46,68.13 61.46,72.25 60.83,72.89 | 60.83,72.89 R3.P$1 | 60.83,72.89 61.14,73.21 61.14,75.75 61.46,76.06 C5.P$2 | R31.P$1 52.57,49.4 52.25,49.08 v51.62,49.08 | v51.62,49.08 | v56.38,50.66 | v56.38,50.66 | Q2.2 56.06,50.98 v56.38,50.66 | v47.81,46.7 | v47.81,46.7 | v47.81,46.7 IC4.2 | v47.81,46.7 | D10.A 41.77,48.28 42.57,49.08 C43.P$2 R27.P$2 | v43.36,45.59 | v43.36,45.59 | v43.36,45.59 C45.P$1
  other vias: 11.3,17.01 11.3,20.82 11.3,24.63 11.3,28.44 11.3,32.25 11.29,43.68 11.29,47.49 11.29,51.3 11.29,55.11 11.29,58.92 11.29,62.73 11.29,66.54 20.18,62.73 20.18,66.54 20.18,58.92 20.18,55.11 20.18,51.3 20.18,47.49 20.18,43.68 20.19,32.25 20.19,28.44 20.19,24.63 20.19,20.82 20.19,17.01 2.41,17.01 29.07,24.63 2.41,20.82 2.41,24.63 2.41,28.44 2.41,32.25 2.41,43.68 2.41,47.49 2.41,51.3 2.41,55.11 2.41,58.92 2.41,62.73 2.41,66.54 2.41,70.35 29.07,28.44 29.07,32.25 29.07,36.06 29.07,39.87 29.07,43.68 29.07,47.49 29.07,51.3 29.07,55.11 29.07,58.92 29.07,62.73 29.07,66.54 11.3,8.12 11.97,69.94 13.9,72.83 26.47,72.83 28.4,69.94 17.58,10.72 14.7,8.8 7.89,8.8 5.01,10.72 3.08,13.61 34.95,9.71 34.95,11.93 34.95,14.15 19.71,7.33 19.71,5.1 19.71,2.88 48.44,16.69 48.44,14.47 48.44,12.25 48.44,21.14 48.44,18.91 62.57,2.88 64.79,2.88 81.78,8.44 77.34,8.44 79.56,8.44 78.45,8.44 72.57,32.25 73.84,32.25 68.76,33.52 70.03,33.52 71.3,33.52 72.57,33.52 73.84,33.52 69.4,34.79 70.67,34.79 71.94,34.79 73.21,34.79 40.66,18.76 40.19,21.3 40.19,23.84 40.19,26.38 44.31,47.97 38.92,61.46 4.35,74.39 4.35,78.2 16.73,85.82 16.73,87.09 16.73,88.36 16.73,89.63 23.59,85.87 23.59,87.14 23.59,88.41 23.59,89.68 47.49,81.78 47.49,80.51 50.03,80.51 50.03,81.78 48.76,80.51 48.76,81.78 74.48,43.84 75.75,43.84 77.02,43.84 74.48,46.06 75.75,46.06 77.02,46.06 74.48,55.11 75.75,55.11 77.02,55.11 74.48,57.33 75.75,57.33 77.02,57.33 61.46,61.78 62.41,60.83 61.46,59.87 62.41,62.73 60.51,60.83 60.51,62.73 63.37,59.87 63.37,61.78 63.37,63.68 59.55,63.68 59.55,61.78 59.55,59.87 77.02,81.94 75.75,81.94 74.48,81.94 77.02,84.16 75.75,84.16 74.48,84.16 69.72,65.43 70.98,65.43 72.25,65.43 68.44,65.43 47.49,86.86 48.76,86.86 50.03,86.86 48.76,85.59 48.76,84.32 48.76,83.05 59.87,78.61 56.86,79.72 61.14,75.11 65.91,77.65 65.91,79.56 65.91,75.11 73.53,75.11 73.53,77.65 65.91,67.81 35.27,66.54 38.92,64.32 42.41,52.57 46.38,54.4 36.7,32.25 37.01,28.12 37.97,36.7 42.89,22.25 42.09,29.39 36.54,25.74 34.31,16.69 87.65,37.65 77.81,32.09 83.69,32.09 89.56,32.09 89.4,43.68 82.73,43.52 79.88,37.65 68.6,39.08 42.09,41.14 82.73,61.62 77.33,61.62 82.73,50.51 82.73,56.22 32.25,65.59 32.25,74.8 32.25,70.35 32.25,79.56 35.42,85.91 41.14,81.78 16.78,74.75 20.18,75.43 23.59,74.75 44.95,81.14 9.77,75.37 9.77,79.81 11.68,82.03 23.42,82.67 20.88,83.62 26.85,77.65 29.87,89.88 42.41,89.88 35.74,89.88 29.71,85.27 61.46,63.68 48.6,54.95 41.3,58.13 46.54,57.49 43.68,75.43 39.55,73.84 56.86,76.54 47.49,75.43 53.84,74.95 36.06,43.84 35.42,52.41 35.27,61.46 33.52,59.71 43.84,61.3 42.25,64.32 35.27,72.57 40.19,67.65 19.55,77.81 17.96,81.14 58.13,89.08 59.4,89.08 61.46,89.08 62.73,89.08 41.46,45.43 40.98,49.08 33.68,39.39 34.47,34.47 33.68,54.79 33.36,49.87 33.36,44.63 42.89,37.01 42.09,34 33.52,20.18 41.14,86.7 28.12,17.01 43.68,11.93 37.01,18.28 19.51,13.61 50.03,75.43 53.68,73.05 2.41,36.06 2.41,39.87 11.3,39.87 11.3,36.06 20.19,36.06 20.19,39.87 40.5,11.93 40.5,15.11 64.16,47.33 60.98,50.82 70.51,54.32 54,56.86 64.63,46.54 82.73,46.06 77.97,50.51 49.24,51.3 23.68,9.71 13.93,78.09 43.68,73.05 49.71,73.05 57.49,40.82 52.41,39.24 53.84,43.68 63.21,47.33 55.75,48.28 54,54.32 59.55,48.6 46.38,41.46 49.24,48.76 57.49,67.17 60.83,71.78 46.38,37.81 50.35,37.81 54.79,37.81 60.19,44.32 61.14,54.32 65.11,47.33 63.68,46.54 87.97,73.05 88.45,46.38 88.29,54.63 88.29,57.81 65.59,46.54 54.63,67.02 51.78,66.22 54.95,62.1 46.22,73.05 41.14,71.14 46.7,70.67 49.87,70.51 60.03,37.81 61.94,79.72 49.87,61.3 80.67,8.44
  pour Bottom (isolate 0.406, rank 5, no thermals): -0.14,90.99 -0.14,-0.14 90.99,-0.14 90.99,90.99
  pour Top (isolate 0.406, rank 5, no thermals): 90.99,90.99 83.05,90.99 83.05,83.05 90.99,83.05
  pour Top (isolate 0.406, rank 5, no thermals): 90.99,7.8 84.32,7.8 83.05,6.53 83.05,-0.14 90.99,-0.14
  pour Top (isolate 0.813, rank 6, no thermals): -0.14,84 -0.14,-0.14 20.03,-0.14 20.03,9.23 24.15,9.23 24.15,15.42 28.44,15.42 28.44,71.3 24.31,75.43 9.71,75.43 9.71,80.19 13.52,84 16.69,84 16.69,90.35 9.71,90.35 9.71,88.45 5.26,84
  pour Top (isolate 0.61, rank 3, no thermals): 67.81,31.61 67.81,34.79 68.13,35.11 74.48,35.11 74.48,31.61
  pour Top (isolate 0.406, rank 5, no thermals): 46.54,57.65 46.54,90.99 90.99,90.99 90.99,57.65
  pour Top (isolate 0.356, rank 5, no thermals): -0.14,90.99 -0.14,84 5.26,84 9.71,88.45 9.71,90.67 16.69,90.67 16.69,84 13.52,84 9.71,80.19 9.71,75.43 24,75.43 28.44,71.3 28.44,16.38 43.68,16.38 43.68,22.73 60.35,22.73 60.35,43.84 62.25,45.74 66.06,45.74 67.81,43.84 67.81,31.61 90.99,31.61 90.99,90.99
  pour Top (isolate 0.406, rank 5, no thermals): 17.8,7.96 19.71,7.96 20.03,7.64 20.03,2.56 19.71,2.25 17.8,2.25
  pour Top (isolate 0.356, rank 5, no thermals): 40.19,11.61 40.19,27.33 43.68,27.33 48.76,22.25 48.76,11.93 48.44,11.61
  pour Top (isolate 0.406, rank 5, no thermals): 61.94,1.29 65.43,1.29 65.43,2.88 65.11,3.2 62.25,3.2 61.94,2.88
  pour Top (isolate 0.356, rank 6, no thermals): 82.26,8.76 76.86,8.76 76.54,8.44 76.54,6.53 82.57,6.53 82.57,8.44
  pour Top (isolate 0.356, rank 5, no thermals): 36.54,14.79 36.54,9.23 35.58,8.28 35.58,6.53 34.79,6.53 34.47,6.85 34.47,14.47 34.79,14.79
N$1
  Top 0.406: R20.P$1 17.96,79.56 D9.C 17.96,79.24 18,79.28 C41.P$1 20.82,79.24 R22.P$1 25.27,79.24 25.58,79.56 25.59,79.56 Q1.1 25.59,79.87 25.27,80.19 25.27,83.69 R21.P$2
N$2
  Top 0.406: L6.2 11.93,78.29 11.93,79.56 R20.P$2 | R20.P$2 | C40.P$1 R20.P$2
N$3
  Top 0.406: 48.92,45.75 48.92,45.74 49.4,45.27 R5.P$2 | 48.92,45.75 IC4.3 | C45.P$2 | C45.P$2 46.54,45.59 | XTAL1.3 45.18,44.38 C45.P$2 | 46.54,45.59 | 48.92,45.75 46.7,45.75 46.54,45.59
N$4
  Top 1.676: FET1.2 72.73,29.71 72.89,29.55
  Top 1.93: XFMR1.2 74.59,27.85 72.89,29.55
N$5
  Top 0.406: D7.A 37.92,16.74 38.44,16.69 38.44,16.81 C37.P$1 38.6,18.6 38.65,18.6 D6.C
N$6
  Top 0.356: 63.24,49.52 IC2.3
  Top 0.406: 63.24,49.52 63.21,49.55 63.18,49.55 IC2.4 63.21,49.52 63.05,49.71 59.24,49.71 56.54,49.71 54.16,49.71 52.09,47.65 IC4.6
N$7
  Top 0.406: IC3.5 40.19,52.89 41.77,51.3 41.77,50.98 | D10.C 41.77,50.98 | 41.77,50.98 41.78,50.98 C43.P$1 44.63,50.98 46.7,50.98 R27.P$1 46.54,51.14 45.91,51.77 R26.P$2
N$8
  Top 0.406: IC1.3 62.73,71.62 62.41,71.94 62.41,73.53 C6.P$2
N$9
  Top 0.406: R19.E 38.92,27.96 38.32,27.37 C39.P$1 38.28,26.38 38.17,26.26 D8.C 36.38,23.84 R18.P$1
N$11
  Top 0.406: XTAL1.1 49.39,39.56 49.4,39.55 C44.P$1 49.4,41.3 R6.P$2
N$13
  Top 0.406: R5.P$1 | R5.P$1 51.3,45.27 51.62,45.59 51.62,45.75 IC4.4 | R6.P$1 R5.P$1
N$14
  Top 0.406: C38.P$1 36.54,21.3 36.38,21.45 36.38,21.46 R18.P$2 36.22,21.45 36.38,21.3 36.22,21.14 D7.C
N$15
  Top 0.406: R7.P$1 | R7.P$1 63.68,51.94 64.48,51.13 IC2.2 | Q2.3 R7.P$1
N$16
  Top 0.406: IC3.2 R23.P$2 36.38,48.92 R24.P$1
N$17
  Top 0.406: R24.P$2 34.48,41.77 R25.S 36.7,41.14 | R33.P$2 36.86,42.25 36.85,42.25 36.7,42.25 36.7,41.14 | R34.P$1 36.7,41.14
N$19
  Top 0.406: R32.A 50.97,64 50.98,64 50.98,62.09 51.14,61.94 | 51.14,61.94 | 51.14,61.94 R4.P$1
N$21
  Top 0.406: 42.73,59.87 42.73,61.78 43.68,62.73 R29.P$1 | IC3.8 42.73,59.87 | IC3.9 42.64,59.78 42.73,59.87
N$22
  Top 0.406: IC3.6 41.46,54.16 41.55,54.24 IC3.7 44.72,54.24 44.95,54.48 R28.P$1
N$23
  Top 0.406: R2.P$1 57.97,73.84 58.29,73.52 R3.P$2 58.29,72.57 58.28,72.57 58.92,71.94 IC1.6 58.92,68.6 58.6,68.29 52.57,68.29 | R32.E 54.17,65.58 52.57,67.17 52.57,68.29 | 52.57,68.44 | R32.S 52.57,68.44 | 52.09,68.29 52.09,68.44 | R11.P$2 51.78,70.19 52.09,69.87 52.09,68.76 | 52.09,68.76 | R32.S 52.09,68.76 | 52.09,68.29 | R32.S 52.09,68.29 | 52.09,68.29 52.57,68.29 | 52.57,68.44 | R32.S 52.57,68.44 | 52.57,68.44 52.57,68.29
N$24
  Top 0.406: 35.11,59.87 34.16,60.83 R30.P$1 | IC3.14 35.11,59.87 | IC3.13 35.2,59.78 35.11,59.87
REF  (via drill 0.5)
  Top 0.406: D3.C v2.41,77.33 C34.P$1 | 30.34,64 30.35,64 | 30.34,64 R16.P$2 | v14.95,76.7 24.95,76.7 30.34,71.3 30.34,64
  Bottom 0.406: v2.41,77.33 3.04,76.7 v14.95,76.7
REG
  Top 0.406: SV1.6 42.41,81.46 41.46,80.51 36.7,80.51 36.06,79.88 36.06,74.64 44.95,65.75 R28.P$2
RF_DET
  Top 0.406: IC3.3 37.65,52.25 38.6,51.3 38.6,47.49 37.65,46.54 37.65,38.28 36.38,37.01 R19.S
RF_EN  (via drill 0.5)
  Top 0.406: v43.68,71.62 43.68,70.19 47.33,66.54 47.33,60.03 50.19,57.18 51.3,56.06 51.3,53.05 52.25,52.09 R31.P$2 53.68,52.09 54.48,52.89 54.48,52.88 Q2.1 | 37.33,75.27 v37.33,75.43 SV1.1 | 56.38,71.94 56.38,70.67 56.86,70.19 57.65,70.19 IC1.7 | 56.38,71.94 R1.P$2 | 56.38,71.94 | v47.17,71.94 56.38,71.94
  Bottom 0.406: v37.33,75.43 37.33,74.32 39.39,72.25 43.05,72.25 v43.68,71.62 44,71.94 v47.17,71.94
RF_OUT
  Top 0.406: 6.83,77.65 6.85,77.65 L6.1
  Top 2.54: PAD1.1 13.2,87.18 6.83,80.81 6.83,77.65 6.85,17.01 arc90 11.29,12.56 arc90 15.74,17.01 15.74,66.54 arc-90 20.18,70.98 arc-90 24.63,66.54 24.63,16.69 28.6,12.72 31.46,12.72
  pour Top (no thermals): 30.5,13.84 30.5,9.07 30.5,7.8 31.62,6.69 32.41,6.69 32.41,8.12 33.36,9.07 33.36,14.95 32.57,14.95 31.46,13.84
RK1
  Top 0.406: D2.A 27.33,19.55 26.85,19.55 26.85,66.54 arc90 20.18,73.21 arc90 13.52,66.54 13.52,17.01 arc-90 11.29,14.79 arc-90 9.07,17.01 9.07,73.21 R12.P$1
RK2
  Top 0.406: R13.P$2 22.41,19.39 22.41,66.54 arc90 20.18,68.76 arc90 17.96,66.54 17.96,17.01 arc-90 11.29,10.34 arc-90 4.63,17.01 4.63,72.89 3.04,72.89 D3.A
TIP_DET
  Top 0.406: Q1.3 26.54,85.59 29.71,88.77 44,88.77 44.95,87.81 SV1.8 44.95,84.32
TOUT
  pour Top (rank 3, no thermals): 73.21,13.36 73.21,11.61 71.94,10.34 71.94,4.31 69.56,4.31 69.56,10.5 68.44,11.61 68.44,13.36
V+
  pour Top (rank 3, no thermals): 81.14,26.85 86.22,26.85 86.22,13.83 82.42,10.02 76.38,10.03 76.38,11.14 75.91,11.61 75.91,13.36 79.88,13.36 81.14,14.63
VF
  Top 0.406: SV1.4 39.87,82.42 39.23,81.78 36.38,81.78 35.11,80.51 35.11,74.32 43.68,65.75 R29.P$2
VFB  (via drill 0.5)
  Top 0.406: R23.P$1 34.47,50.66 34.47,53.36 35.11,54 IC3.1 35.11,55.27 35.58,55.74 40.98,55.74 v42.09,56.86 | R4.P$2 | R4.P$2 | v52.41,59.71 53.52,60.83 R4.P$2
  Bottom 0.406: v52.41,59.71 44.95,59.71 v42.09,56.86
VFWD
  Top 0.406: R14.P$1 R15.P$1 C35.P$1 35.11,26.54 35.74,27.17 35.74,30.98 32.25,34.47 32.25,55.11 33.84,56.7 38.92,56.7 40.19,57.97 IC3.10 40.19,60.83 40.82,61.46 D4.C
VIN
  Top 0.406: 64,78.61 C2.P$1
  Top 0.813: IC1.2 64,72.25
  Top 1.422: 64,72.25 64,78.61
  pour Top (isolate 0.406, rank 3, no thermals): 52.09,76.06 52.09,86.22 67.17,86.22 68.13,85.27 68.13,81.78 67.17,80.83 65.59,80.83 64.64,79.88 64.64,74.48 63.37,74.48 63.37,79.88 62.41,80.83 55.74,80.83 55.74,76.06
VLIM  (via drill 0.5)
  Top 0.406: v39.87,75.43 SV1.3 | v47.17,74.16 51.3,74.16 51.78,73.68 51.78,73.37 | 51.78,73.37 | 51.78,73.37 R11.P$1
  Bottom 0.406: v47.17,74.16 40.98,74.16 v39.87,75.43
VR
  Top 0.406: R30.P$2 34.16,81.78 36.76,84.39 SV1.2
VREF
  Top 0.406: D5.C 37.01,61.46 37.65,60.83 IC3.12 37.65,58.6 37.33,58.28 C36.P$1 | R16.P$1 31.93,61.15 R17.P$1 C36.P$1 | C36.P$1
VREG  (via drill 0.5)
  Top 0.406: v66.7,76.38 86.54,76.38 89.4,73.53 89.4,45.59 88.77,44.95 C8.+ 86.07,44.95 86.07,44.79 81.78,44.79 70.98,55.59 v55.43,55.59 | v59.87,76.38 R2.P$2 | R26.P$1 v48.76,52.57 | v48.76,52.57
  Bottom 0.406: v66.7,76.38 v59.87,76.38 | v48.76,52.57 51.78,55.59 v55.43,55.59
  pour Top (isolate 0.406, rank 3, no thermals): 81.14,34.63 86.38,34.63 86.38,38.44 87.5,39.55 87.5,71.62 84,71.62 84,41.3 81.14,38.44
VSW
  pour Top (isolate 0.406, rank 3, no thermals): 65.27,69.08 67.17,69.08 69.72,66.54 77.02,66.54 77.02,71.62 74.8,73.84 65.27,73.84

### Text on the board
Top: Top
Bottom: Bottom
tPlace: RF Out
tStop: RF-Gen V0.3 | 13.56MHz Output Stage | (c) 2012 Christian Klippel